# EAGLE design 150529-Sequencer_rev_04 (EAGLE 6.6.0)
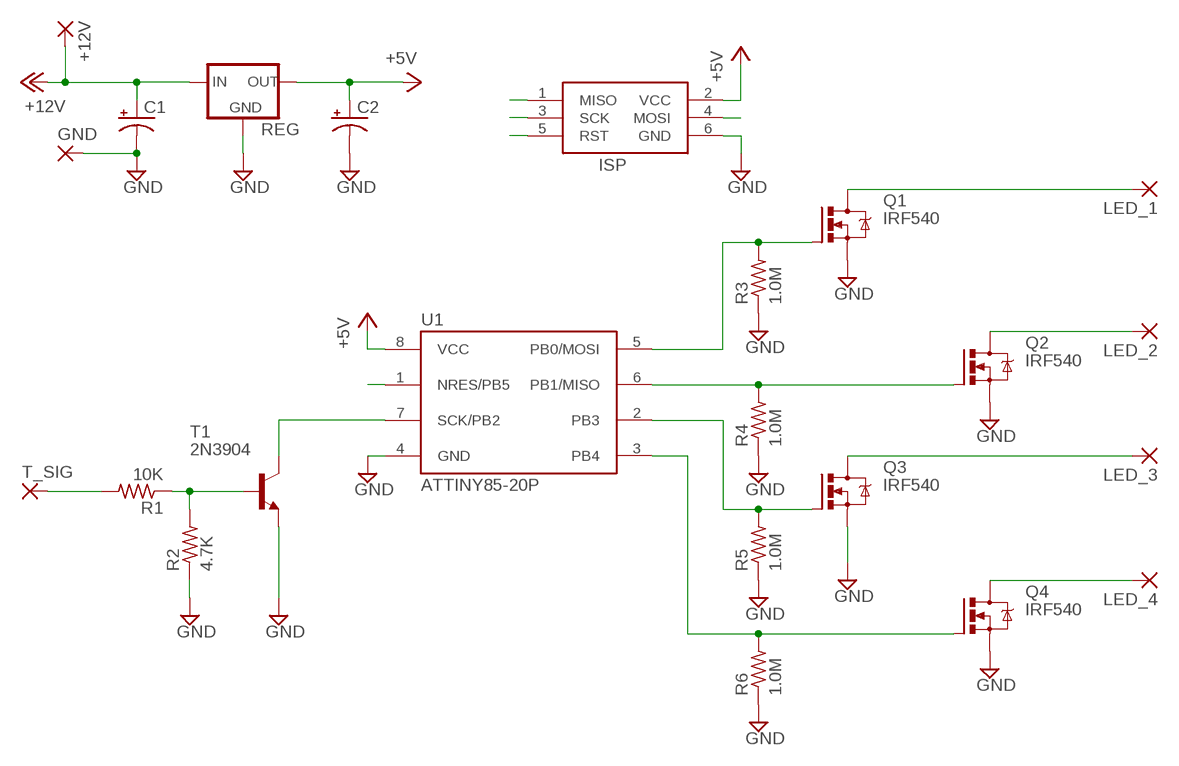
[diagram p0: schematic, sheet 1]

## Parts
+12V  1,6/0,8  [1,6/0,8]
C1  CPOL-USE5-10.5  [E5-10,5]
C2  CPOL-USE5-10.5  [E5-10,5]
GND  1,6/0,8  [1,6/0,8]
ISP  AVRISP-6  [AVRISP]
LED_1  1,6/0,8  [1,6/0,8]
LED_2  1,6/0,8  [1,6/0,8]
LED_3  1,6/0,8  [1,6/0,8]
LED_4  1,6/0,8  [1,6/0,8]
Q1  IRF540  [TO220BV]
Q2  IRF540  [TO220BV]
Q3  IRF540  [TO220BV]
Q4  IRF540  [TO220BV]
R1  10K  R-US_0207/2V  [0207/2V]
R2  4.7K  R-US_0207/2V  [0207/2V]
R3  1.0M  R-US_0207/2V  [0207/2V]
R4  1.0M  R-US_0207/2V  [0207/2V]
R5  1.0M  R-US_0207/2V  [0207/2V]
R6  1.0M  R-US_0207/2V  [0207/2V]
REG  78XXS  [78XXS]
T1  2N3904  [TO92]
T_SIG  1,6/0,8  [1,6/0,8]
U1  ATTINY85-20P  [PDIP08_300MIL]

## Nets
+5V [Pwr]: C2.+ ISP.2(VCC) REG.OUT U1.8(VCC)
+12V [Pwr]: +12V.1(P) C1.+ REG.IN
GND [Pwr]: C1.- C2.- GND.1(P) ISP.6(GND) Q1.S Q2.S Q3.S Q4.S R2.1 R3.1 R4.1 R5.1 R6.1 REG.GND T1.3(E) U1.4(GND)
LED_1 [Pwr]: LED_1.1(P) Q1.D
LED_2 [Pwr]: LED_2.1(P) Q2.D
LED_3 [Pwr]: LED_3.1(P) Q3.D
LED_4 [Pwr]: LED_4.1(P) Q4.D
N$11: R1.1 R2.2 T1.2(B)
NRES/PB5: ISP.5(RST) U1.1(NRES/PB5)
PB0/MOSI: ISP.4(MOSI) Q1.G R3.2 U1.5(PB0/MOSI)
PB1/MISO: ISP.1(MISO) Q2.G R4.2 U1.6(PB1/MISO)
PB3: Q3.G R5.2 U1.2(PB3)
PB4: Q4.G R6.2 U1.3(PB4)
SCK/PB2: ISP.3(SCK) T1.1(C) U1.7(SCK/PB2)
T_SIG: R1.2 T_SIG.1(P)

## Library data of the parts
+12V GND LED_1-LED_4 T_SIG = wirepad:1,6/0,8: THROUGH-HOLE PAD
C1 C2 = adafruit:CPOL-US: POLARIZED CAPACITOR, American symbol
ISP = adafruit:AVRISP: AVR ISP HEADER Standard 6 pin header for AVR programming
Q1-Q4 = transistor-power:IRF540: HEXFET Power MOSFET
R1-R6 = rcl:R-US_: RESISTOR, American symbol
REG = v-reg:78XXS: VOLTAGE REGULATOR
T1 = transistor:2N3904: NPN TRANSISTOR
U1 = ZZ-MLP_tiny85_for_sequencer:ATTINY85*: ATMEL ATtiny 85 Packages: P = PDIP 08 30mil S = SOIC 08 EIAJ 208mil Technologies Note: for complete ordering code (temp. range, finish, tape&reel etc.) see www.atmel.com • Supply Voltage: V = (1.8…5.5)V | [blank] = (2.7…5.5)V • Speed: 10 = 10 MHz | 20 = 20 MHz Author: Dipl.-Ing. FH Rainer Bayer HHN Hochschule Heilbronn (Heilbronn University), rainer.bayer@hs-heilbronn.de Ingenieurbüro ing-rb, mail@ing-rb.de

## Net classes
0 default: width 0.305 mm
1 Pwr: width 0.61 mm

## Board
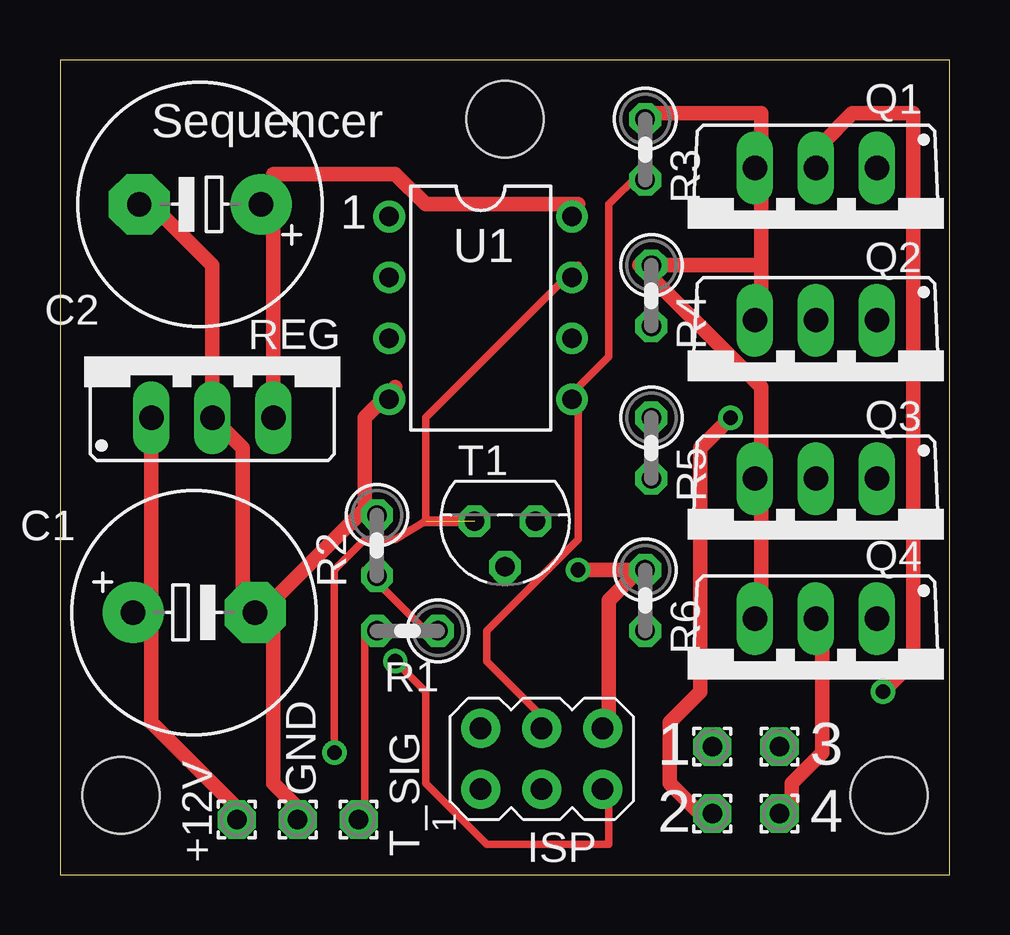
[diagram p1: board, top side]
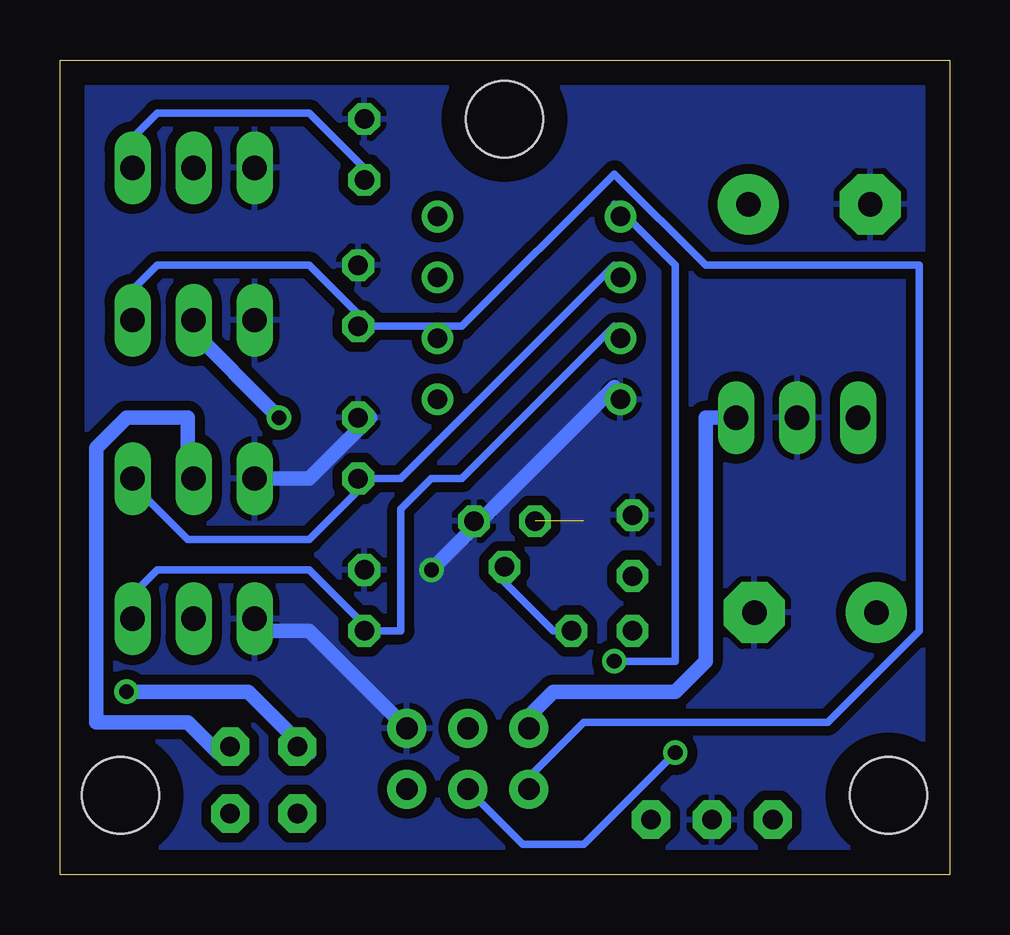
[diagram p2: board, bottom side, seen from below]

Size 37.06 x 33.96 mm. Coordinates in mm from the lower left corner, seen from the top.
Outline: 0,0 37.06,0 37.06,33.96 0,33.96 0,0
Copper layers (1*16): Top 0.035mm / dielectric 1.5mm / Bottom 0.035mm
Design rules "default": minimum track width 10mil, minimum drill 24mil, track to track 8mil, track to pad 8mil, pad to pad 8mil, via to via 8mil, smd to smd 8mil, copper to edge 40mil, drill to drill 8mil, minimum pad ring 10mil, minimum via ring 8mil, stop-mask expansion 4mil, vias tented up to drill 0mil, thermal gap 10mil
Holes 3.2 mm at 2.54,3.3 18.54,31.5 34.54,3.3

### Footprints (pad centres in the part's own frame; a part is rotated, then mirrored left to right if it is on the bottom)
1,6/0,8 = drill 0.813 pad 1.6 octagon: 1 0,0
E5-10,5 = drill 1.016 pad 2.54: + -2.54,0 | drill 1.016 pad 2.54 octagon: - 2.54,0
AVRISP = drill 0.9 pad 1.626: 1 -1.27,2.54; 2 1.27,2.54; 3 -1.27,0; 4 1.27,0; 5 -1.27,-2.54; 6 1.27,-2.54
TO220BV = drill 1.016 long: D 0,-2.54; G -2.54,-2.54; S 2.54,-2.54
0207/2V = drill 0.813 octagon: 1 -1.27,0; 2 1.27,0
78XXS = drill 1.016 long: GND 0,-2.54; IN -2.54,-2.54; OUT 2.54,-2.54
TO92 = drill 0.813 octagon: 1 1.27,0; 2 0,1.905; 3 -1.27,0
PDIP08_300MIL = drill 0.813: 1 -3.81,-3.81; 2 -1.27,-3.81; 3 1.27,-3.81; 4 3.81,-3.81; 5 3.81,3.81; 6 1.27,3.81; 7 -1.27,3.81; 8 -3.81,3.81

### Placement (x,y rotation side)
+12V  7.37,2.29 0 top
C1  5.59,10.92 0 top
C2  5.84,27.94 180 top
GND  9.91,2.29 0 top
ISP  20.07,4.83 90 top
LED_1  27.18,5.33 0 top
LED_2  27.18,2.54 0 top
LED_3  29.97,5.33 0 top
LED_4  29.97,2.54 0 top
Q1  31.5,26.92 180 top
Q2  31.5,20.57 180 top
Q3  31.5,13.97 180 top
Q4  31.5,8.13 180 top
R1  14.48,10.16 180 top
R2  13.21,13.72 270 top
R3  24.38,30.23 270 top
R4  24.64,24.13 270 top
R5  24.64,17.78 270 top
R6  24.38,11.43 270 top
REG  6.35,21.59 0 top
T1  18.54,14.73 180 top
T_SIG  12.45,2.29 0 top
U1  17.53,23.62 270 top

### Tracks (layer width: path | path; a pad name or v marks a point on that pad's centre or on a via)
+5V
  Top 0.61: 8.89,27.94 8.89,29.21 13.97,29.21 15.24,27.94 21.59,27.94 U1.8 | 8.89,27.94 REG.OUT | 8.89,27.94 C2.+
  Bottom 0.61: REG.OUT 10.16,19.05 10.16,8.89 11.43,7.62 16.51,7.62 17.78,6.35 ISP.2
+12V
  Top 0.61: REG.IN 3.81,11.43 C1.+ 3.81,10.16 3.81,6.35 7.62,2.54 +12V.1
GND  (via drill 0.61)
  Top 0.61: R3.1 24.13,31.75 29.21,31.75 29.21,30.48 Q1.S 29.21,29.21 29.21,25.4 | 29.21,25.4 R4.1 24.13,25.4 29.21,20.32 29.21,16.51 | 29.21,25.4 29.21,24.13 Q2.S | 24.13,12.7 22.86,11.43 22.86,6.35 ISP.6 | 29.21,16.51 29.21,11.43 Q4.S | 29.21,16.51 Q3.S | 12.7,15.24 8.89,11.43 C1.- | 12.7,15.24 12.7,19.05 13.97,20.32 U1.4 | 12.7,15.24 R2.1 | C1.- 7.62,11.43 7.62,17.78 REG.GND 6.35,25.4 3.81,27.94 C2.- | GND.1 10.16,2.54 8.89,3.81 8.89,10.16 C1.- | v21.59,12.7 24.13,12.7 | 24.13,12.7 R6.1
  Bottom 0.61: R5.1 24.13,19.05 26.67,16.51 Q3.S 29.21,16.51 | ISP.6 26.67,10.16 29.21,10.16 Q4.S | v21.59,12.7 13.97,20.32 U1.4
  pour Bottom (isolate 0.406): 0,34.04 37.08,34.04 37.08,0 0,0
LED_1  (via drill 0.61)
  Top 0.61: v34.29,7.62 35.56,8.89 35.56,31.75 33.02,31.75 31.75,30.48 Q1.D
  Bottom 0.61: v34.29,7.62 29.21,7.62 26.67,5.08 LED_1.1
LED_2  (via drill 0.61)
  Top 0.61: v27.94,19.05 26.67,17.78 26.67,7.62 25.4,6.35 25.4,3.81 26.67,2.54 LED_2.1
  Bottom 0.61: v27.94,19.05 31.75,22.86 Q2.D
LED_3
  Bottom 0.61: Q3.D 31.75,16.51 31.75,19.05 34.29,19.05 35.56,17.78 35.56,6.35 31.75,6.35 30.48,5.08 LED_3.1
LED_4
  Top 0.61: Q4.D 31.75,10.16 31.75,5.08 30.48,3.81 30.48,2.54 LED_4.1
N$11
  Top 0.305: R1.1 15.24,10.16 12.7,12.7 R2.2
  Bottom 0.305: T1.2 19.05,12.7 16.51,10.16 R1.1 15.24,10.16
NRES/PB5  (via drill 0.61)
  Top 0.305: v13.97,8.89 15.24,7.62 15.24,3.81 17.78,1.27 22.86,1.27 22.86,3.81 ISP.5
  Bottom 0.305: v13.97,8.89 11.43,8.89 11.43,25.4 13.97,27.94 U1.1
PB0/MOSI
  Top 0.305: 21.59,20.32 22.86,21.59 22.86,27.94 24.13,29.21 R3.2 | 21.59,20.32 21.59,13.97 17.78,10.16 17.78,8.89 20.32,6.35 ISP.4 | 21.59,20.32 U1.5
  Bottom 0.305: Q1.G 34.29,30.48 33.02,31.75 26.67,31.75 24.13,29.21 R3.2
PB1/MISO
  Bottom 0.305: 24.13,22.86 21.59,22.86 | 24.13,22.86 26.67,25.4 33.02,25.4 34.29,24.13 Q2.G | 24.13,22.86 R4.2 | 21.59,22.86 20.32,22.86 13.97,29.21 10.16,25.4 1.27,25.4 1.27,10.16 5.08,6.35 15.24,6.35 17.78,3.81 ISP.1 | 21.59,22.86 U1.6
PB3
  Bottom 0.305: 24.13,16.51 22.86,16.51 13.97,25.4 U1.2 | 24.13,16.51 26.67,13.97 31.75,13.97 34.29,16.51 Q3.G | 24.13,16.51 R5.2
PB4
  Bottom 0.305: 24.13,10.16 22.86,10.16 22.86,15.24 21.59,16.51 20.32,16.51 13.97,22.86 U1.3 | 24.13,10.16 26.67,12.7 33.02,12.7 34.29,11.43 Q4.G | 24.13,10.16 R6.2
SCK/PB2  (via drill 0.61)  (1 unrouted)
  Top 0.305: v11.43,5.08 11.43,12.7 12.7,13.97 13.97,13.97 15.24,14.73 15.24,19.05 21.59,25.4 U1.7
  Top 0.406: 15.24,14.73 17.02,14.73
  Bottom 0.305: v11.43,5.08 15.24,1.27 17.78,1.27 ISP.3 20.32,3.81
T_SIG
  Top 0.305: R1.2 12.7,10.16 12.7,2.54 T_SIG.1

### Text on the board
tNames: Sequencer | 1 | 1 | 1 | 3 | 2 | 4